# Altium project Combined.PrjPCB
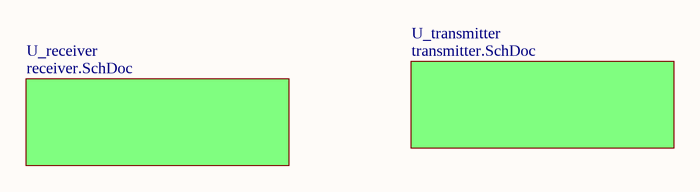
[diagram p0: Combined.SchDoc]
3 sheets, 92 parts. Net scope: global (net labels, ports and power ports of the same name join across sheets).
Board file: Combined.PcbDoc
Sheets:
  Combined.SchDoc
    U_receiver = receiver.SchDoc
    U_transmitter = transmitter.SchDoc

## Sheet Combined.SchDoc
size A

### Sub-sheets
U_receiver = receiver.SchDoc: no entries
U_transmitter = transmitter.SchDoc: no entries

## Sheet receiver.SchDoc: MW Bench - Receiver
size A3; Organization: Altium Limited; Address1: L3, 12a Rodborough Rd; Address2: Frenchs Forest; Address3: NSW; Address4: Australia 2086; SheetNumber: 2; SheetTotal: 2
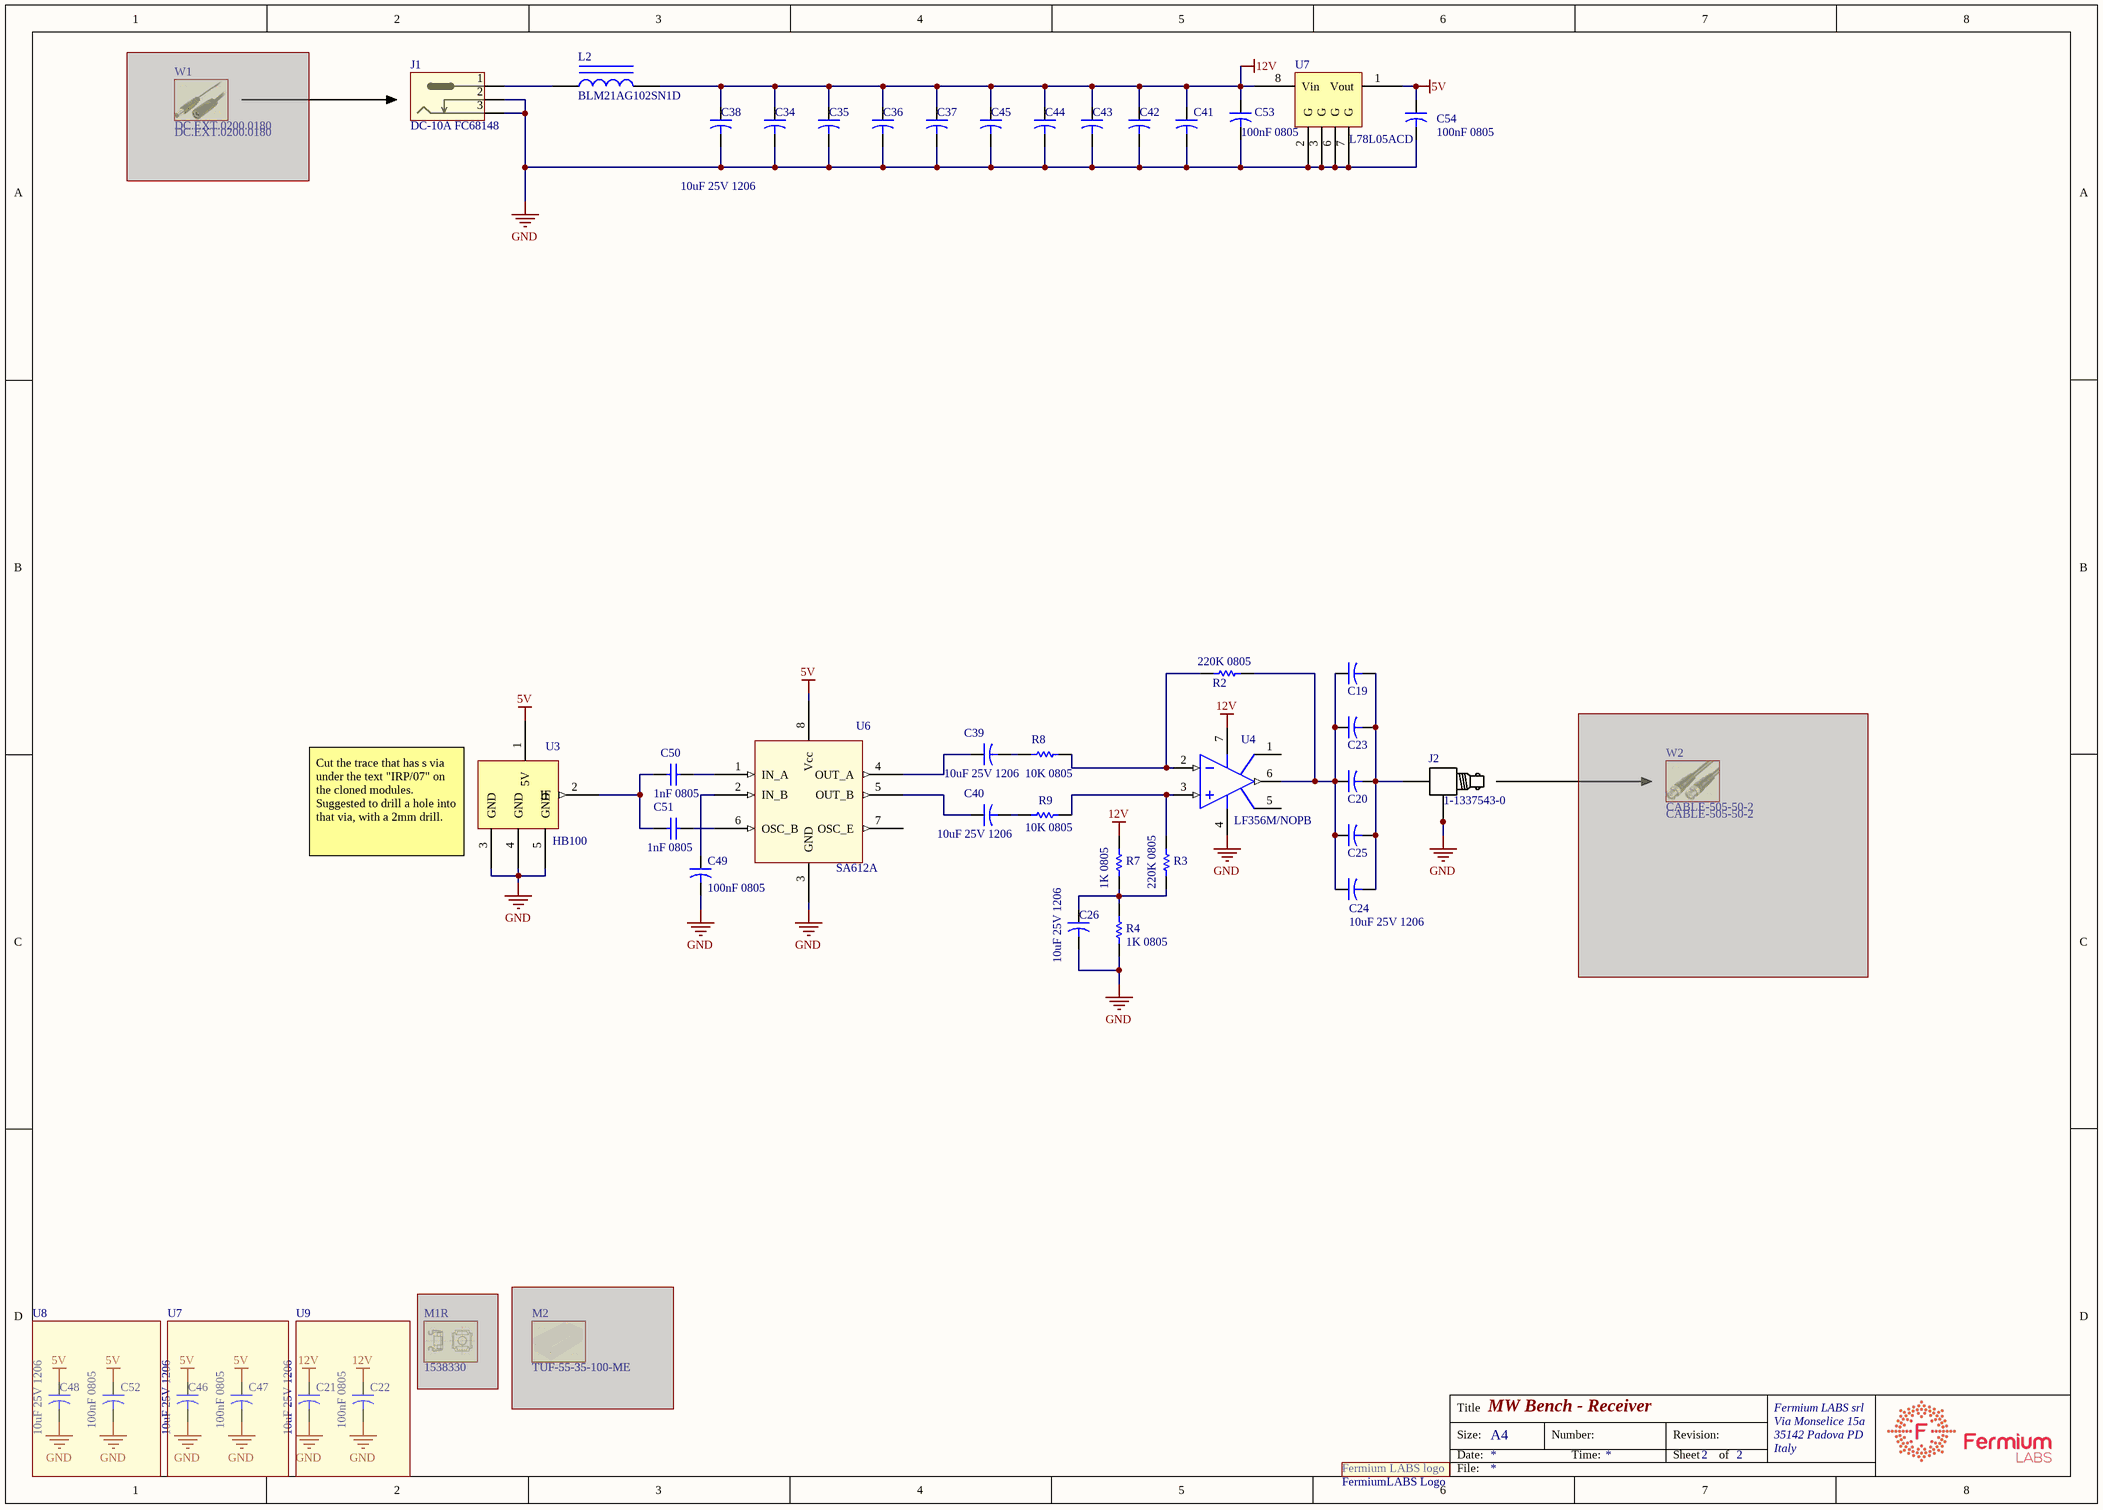
[diagram p1: receiver.SchDoc]

### Parts
(Parts that share a designator on the sheet are numbered #1, #2 ... from top to bottom, then left to right.)
C19  10uF 25V 1206  [CAP 1206_3216]  (value not drawn)
C20  10uF 25V 1206  [CAP 1206_3216]  (value not drawn)
C21  10uF 25V 1206  [CAP 1206_3216]
C22  100nF 0805  [CAP 0805_2012]
C23  10uF 25V 1206  [CAP 1206_3216]  (value not drawn)
C24  10uF 25V 1206  [CAP 1206_3216]
C25  10uF 25V 1206  [CAP 1206_3216]  (value not drawn)
C26  10uF 25V 1206  [CAP 1206_3216]
C34  10uF 25V 1206  [CAP 1206_3216]  (value not drawn)
C35  10uF 25V 1206  [CAP 1206_3216]  (value not drawn)
C36  10uF 25V 1206  [CAP 1206_3216]  (value not drawn)
C37  10uF 25V 1206  [CAP 1206_3216]  (value not drawn)
C38  10uF 25V 1206  [CAP 1206_3216]
C39  10uF 25V 1206  [CAP 1206_3216]
C40  10uF 25V 1206  [CAP 1206_3216]
C41  10uF 25V 1206  [CAP 1206_3216]  (value not drawn)
C42  10uF 25V 1206  [CAP 1206_3216]  (value not drawn)
C43  10uF 25V 1206  [CAP 1206_3216]  (value not drawn)
C44  10uF 25V 1206  [CAP 1206_3216]  (value not drawn)
C45  10uF 25V 1206  [CAP 1206_3216]  (value not drawn)
C46  10uF 25V 1206  [CAP 1206_3216]
C47  100nF 0805  [CAP 0805_2012]
C48  10uF 25V 1206  [CAP 1206_3216]
C49  100nF 0805  [CAP 0805_2012]
C50  1nF 0805  [CAP 0805_2012]
C51  1nF 0805  [CAP 0805_2012]
C52  100nF 0805  [CAP 0805_2012]
C53  100nF 0805  [CAP 0805_2012]
C54  100nF 0805  [CAP 0805_2012]
J1  DC-10A FC68148  [dc-jack]  (no BOM)
J2  1-1337543-0  [BNC-RA]
L2  BLM21AG102SN1D  [FER 0805_2012]
M1R  1538330  (mechanical)  (masked out: inside a compile mask, not in the netlist)
M2#1  TUF-55-35-100-ME  (mechanical)  (masked out: inside a compile mask, not in the netlist)
R2  220K 0805  [RES 0805_2012]
R3  220K 0805  [RES 0805_2012]
R4  1K 0805  [RES 0805_2012]
R7  1K 0805  [RES 0805_2012]
R8  10K 0805  [RES 0805_2012]
R9  10K 0805  [RES 0805_2012]
U3#1  HB100  [HB100-buried]
U4  LF356M/NOPB  [TI SOIC-8 D]
U6  SA612A  [TI SOIC-8 D]
U7  L78L05ACD  [ST SOIC-8N]
W1#1  DC.EXT.0200.0180  (mechanical)  (masked out: inside a compile mask, not in the netlist)
W2#1  CABLE-505-50-2  (mechanical)  (masked out: inside a compile mask, not in the netlist)
XX1  FermiumLABS Logo  [frm-med]  (no BOM)

### Blocks framed on the sheet
U8: C48 C52
U7: C46 C47
U9: C21 C22

### Nets
5V: C46.1 C47.1 C48.1 C52.1 C54.1 U3#1.1(5V) U6.8(Vcc) U7.1(Vout)
12V: C21.1 C22.1 C34.1 C35.1 C36.1 C37.1 C38.1 C41.1 C42.1 C43.1 C44.1 C45.1 C53.1 L2.2 R7.2 U4.7(VDD+) U7.8(Vin)
GND: C21.2 C22.2 C26.2 C34.2 C35.2 C36.2 C37.2 C38.2 C41.2 C42.2 C43.2 C44.2 C45.2 C46.2 C47.2 C48.2 C49.2 C52.2 C53.2 C54.2 J1.2 J1.3 J2.2(gnd) J2.A J2.B R4.1 U3#1.3(GND) U3#1.4(GND) U3#1.5(GND) U4.4(VDD-) U6.3(GND) U7.2(G) U7.3(G) U7.6(G) U7.7(G)
NetC19_1: C19.1 C20.1 C23.1 C24.1 C25.1 R2.2 U4.6(OUT)
NetC19_2: C19.2 C20.2 C23.2 C24.2 C25.2 J2.1
NetC26_1: C26.1 R3.1 R4.2 R7.1
NetC39_1: C39.1 U6.4(OUT_A)
NetC39_2: C39.2 R8.1
NetC40_1: C40.1 U6.5(OUT_B)
NetC40_2: C40.2 R9.1
NetC49_1: C49.1 U6.2(IN_B)
NetC50_1: C50.1 C51.1 U3#1.2(IF)
NetC50_2: C50.2 U6.1(IN_A)
NetC51_2: C51.2 U6.6(OSC_B)
NetJ1_1: J1.1 L2.1
NetR2_1: R2.1 R8.2 U4.2(IN-)
NetR3_2: R3.2 R9.2 U4.3(IN+)

Not connected (* = marked no-connect by the designer): U4 1(CXA) 5; U6 7(OSC_E)

### Notes on the sheet
- (near U3#1) Cut the trace that has s via under the text "IRP/07" on the cloned modules. Suggested to drill a hole into that via, with a 2mm drill.
- Title
- Size:
- Date:
- A4
- Number:
- Time:
- Revision:
- Sheet
- of
- Fermium LABS srl
- Via Monselice 15a
- 35142 Padova PD
- Italy
- File:
- (in symbol fermiumlabs-logo) Fermium LABS logo

### Library data of the parts
C19-C21 C23-C26 C34-C46 C48 = C10uF: Capacitor; Manufacturer: SAMSUNG; Manufacturer Part Number: CL31A106KAHNNNE; Part Number: C10uF
C22 C47 C49 C52-C54 = C100nF: Capacitor; Manufacturer: YAGEO; Manufacturer Part Number: CC0805JRX7R9BB104; Part Number: C100nF
C50 C51 = C1nF: Capacitor; Manufacturer: Samsung; Manufacturer Part Number: CL21B102KCANNNC; Part Number: C1nF
J1 = jackdc: Manufacturer: CLIFF; Manufacturer Part Number: DC-10A FC68148; Part Number: jackdc
J2 = BNC-PCB-RA: connector bnc; Manufacturer: TE CONNECTIVITY; Manufacturer Part Number: 1-1337543-0; Part Number: BNC-PCB-RA
L2 = Inductor Iron: Magnetic-Core Inductor; Manufacturer: Murata; Manufacturer Part Number: BLM21AG102SN1D; Part Number: Inductor Iron
M1R = B6/0.7-1.6/BN3307: Manufacturer: Bossard; Part Number: B6/0.7-1.6/BN3307; Manufacturer Part Number: 1538330
R2 R3 = R220K: Resistor; Manufacturer: Vishay; Manufacturer Part Number: CRCW0805220KFKEA; Part Number: R220K
R4 R7 = R1K: Resistor; Manufacturer: Royal Electronic Factory; Manufacturer Part Number: 0805S8J0102T5E; Part Number: R1K
R8 R9 = R10K: Resistor; Manufacturer: Royal Electronic Factory; Manufacturer Part Number: 0805S8J0103T5E; Part Number: R10K
U3#1 = HB100: Manufacturer: China unspecified; Manufacturer Part Number: HB100; Part Number: HB100
U4 = LF358: Manufacturer: Texas Instruments; Part Number: LF358; Manufacturer Part Number: LF356M/NOPB
U6 = SA612A: Manufacturer: NXP; Manufacturer Part Number: SA612AD; Supplier 1: TME; Supplier 2: Mouser; Supplier Part Number 2: 771-SA612AD01112; Supplier Part Number 1: SA612AD
U7 = L78L05ACD: Manufacturer: ST Microelectronics; Part Number: L78L05ACD; Manufacturer Part Number: L78L05ACD
XX1 = fermiumlabs-logo: Part Number: fermiumlabs-logo
M2#1 = TUF-55-35-100-ME: Supplier 1: TME; Supplier Part Number 1: TUF-55-35-100-ME
W1#1 = DC.EXT.0200.0180: Supplier 1: TME; Supplier Part Number 1: DC.EXT.0200.0180
W2#1 = CABLE-505-50-2: Supplier 1: TME; Supplier Part Number 1: CABLE-505-50-2

## Sheet transmitter.SchDoc: MW Bench - Transmitter
size A3; Organization: Altium Limited; Address1: L3, 12a Rodborough Rd; Address2: Frenchs Forest; Address3: NSW; Address4: Australia 2086; SheetNumber: 1; SheetTotal: 2
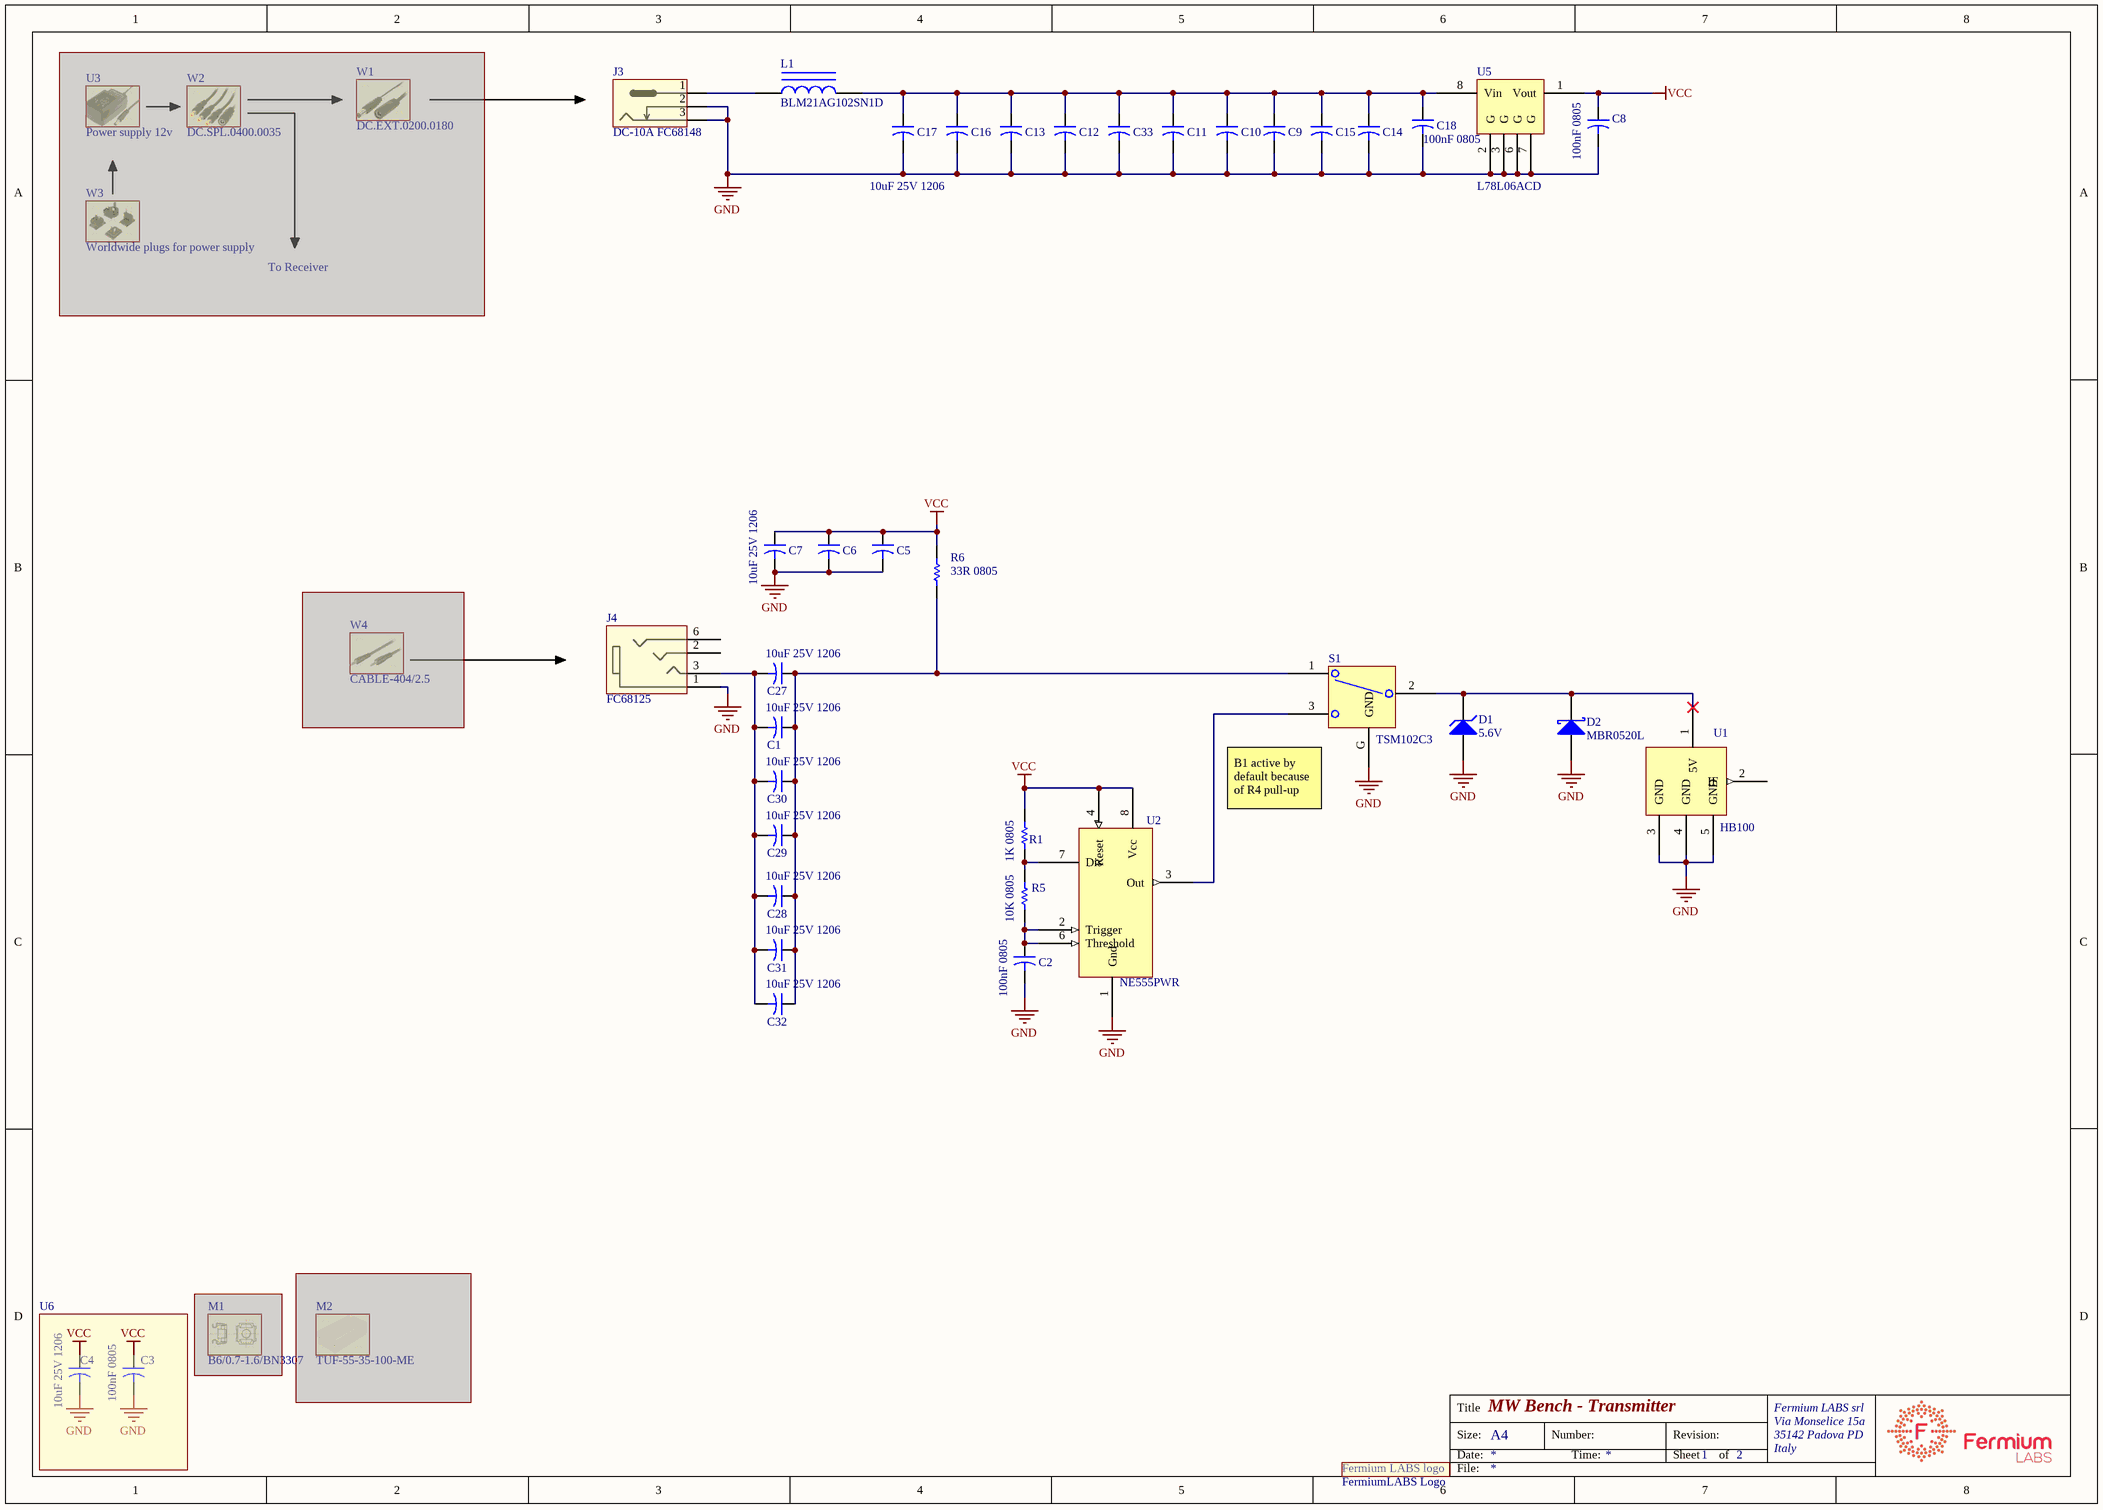
[diagram p2: transmitter.SchDoc]

### Parts
(Parts that share a designator on the sheet are numbered #1, #2 ... from top to bottom, then left to right.)
C1  10uF 25V 1206  [CAP 1206_3216]
C2  100nF 0805  [CAP 0805_2012]
C3  100nF 0805  [CAP 0805_2012]
C4  10uF 25V 1206  [CAP 1206_3216]
C5  10uF 25V 1206  [CAP 1206_3216]  (value not drawn)
C6  10uF 25V 1206  [CAP 1206_3216]  (value not drawn)
C7  10uF 25V 1206  [CAP 1206_3216]
C8  100nF 0805  [CAP 0805_2012]
C9  10uF 25V 1206  [CAP 1206_3216]  (value not drawn)
C10  10uF 25V 1206  [CAP 1206_3216]  (value not drawn)
C11  10uF 25V 1206  [CAP 1206_3216]  (value not drawn)
C12  10uF 25V 1206  [CAP 1206_3216]  (value not drawn)
C13  10uF 25V 1206  [CAP 1206_3216]  (value not drawn)
C14  10uF 25V 1206  [CAP 1206_3216]  (value not drawn)
C15  10uF 25V 1206  [CAP 1206_3216]  (value not drawn)
C16  10uF 25V 1206  [CAP 1206_3216]  (value not drawn)
C17  10uF 25V 1206  [CAP 1206_3216]
C18  100nF 0805  [CAP 0805_2012]
C27  10uF 25V 1206  [CAP 1206_3216]
C28  10uF 25V 1206  [CAP 1206_3216]
C29  10uF 25V 1206  [CAP 1206_3216]
C30  10uF 25V 1206  [CAP 1206_3216]
C31  10uF 25V 1206  [CAP 1206_3216]
C32  10uF 25V 1206  [CAP 1206_3216]
C33  10uF 25V 1206  [CAP 1206_3216]  (value not drawn)
D1  5.6V  [SOD123]
D2  MBR0520L  [SOD123]
J3  DC-10A FC68148  [dc-jack]  (no BOM)
J4  FC68125  [FC68125]
L1  BLM21AG102SN1D  [FER 0805_2012]
M1  B6/0.7-1.6/BN3307  (mechanical)  (masked out: inside a compile mask, not in the netlist)
M2#2  TUF-55-35-100-ME  (mechanical)  (masked out: inside a compile mask, not in the netlist)
R1  1K 0805  [RES 0805_2012]
R5  10K 0805  [RES 0805_2012]
R6  33R 0805  [RES 0805_2012]
S1  TSM102C3  [TSM102C3]
U1  HB100  [HB100-buried]
U2  NE555PWR  [TSSOP8]
U3#2  Power supply 12v  (mechanical)  (masked out: inside a compile mask, not in the netlist)
U5  L78L06ACD  [ST SOIC-8N]
W1#2  DC.EXT.0200.0180  (mechanical)  (masked out: inside a compile mask, not in the netlist)
W2#2  DC.SPL.0400.0035  (mechanical)  (masked out: inside a compile mask, not in the netlist)
W3  Worldwide plugs for power supply  (mechanical)  (masked out: inside a compile mask, not in the netlist)
W4  CABLE-404/2.5  (mechanical)  (masked out: inside a compile mask, not in the netlist)
XX2  FermiumLABS Logo  [frm-med]  (no BOM)

### Blocks framed on the sheet
U6: C3 C4

### Nets
GND: C2.2 C3.2 C4.2 C5.2 C6.2 C7.2 C8.2 C9.2 C10.2 C11.2 C12.2 C13.2 C14.2 C15.2 C16.2 C17.2 C18.2 C33.2 D1.A D2.A J3.2 J3.3 J4.1 S1.G(GND) U1.3(GND) U1.4(GND) U1.5(GND) U2.1(Gnd) U5.2(G) U5.3(G) U5.6(G) U5.7(G)
VCC: C3.1 C4.1 C5.1 C6.1 C7.1 C8.1 R1.2 R6.1 U2.4(Reset) U2.8(Vcc) U5.1(Vout)
NetC1_1: C1.1 C27.1 C28.1 C29.1 C30.1 C31.1 C32.1 R6.2 S1.1
NetC1_2: C1.2 C27.2 C28.2 C29.2 C30.2 C31.2 C32.2 J4.3
NetC2_1: C2.1 R5.1 U2.2(Trigger) U2.6(Threshold)
NetC9_1: C9.1 C10.1 C11.1 C12.1 C13.1 C14.1 C15.1 C16.1 C17.1 C18.1 C33.1 L1.2 U5.8(Vin)
NetD1_K: D1.K D2.K S1.2 U1.1(5V)
NetJ3_1: J3.1 L1.1
NetR1_1: R1.1 R5.2 U2.7(Dis)
NetS1_3: S1.3 U2.3(Out)

Not connected (* = marked no-connect by the designer): J4 2 6; U1 2(IF)

### Notes on the sheet
- To Receiver
- (near S1) B1 active by default because of R4 pull-up
- Title
- Size:
- Date:
- A4
- Number:
- Time:
- Revision:
- Sheet
- of
- Fermium LABS srl
- Via Monselice 15a
- 35142 Padova PD
- Italy
- File:
- (in symbol fermiumlabs-logo) Fermium LABS logo

### Library data of the parts
C1 C4-C7 C9-C17 C27-C33 = C10uF: as C19 on sheet receiver
C2 C3 C8 C18 = C100nF: as C22 on sheet receiver
D1 = D Zener: Zener Diode; Manufacturer: Diodes; Manufacturer Part Number: BZT52C5V6-7-F; Part Number: D Zener
D2 = D Schottky: Schottky Diode; Manufacturer: FAIRCHILD SEMICONDUCTOR; Manufacturer Part Number: MBR0520L; Part Number: D Schottky
J3 = jackdc: Manufacturer: CLIFF; Manufacturer Part Number: DC-10A FC68148; Part Number: jackdc
J4 = FC68125: Manufacturer: CLIFF; Manufacturer Part Number: FC68125; Part Number: FC68125
L1 = Inductor Iron: as L2 on sheet receiver; Manufacturer Part Number: BLM21AG102SN1D; Part Number: Inductor Iron
R1 = R1K: as R4 on sheet receiver
R5 = R10K: as R8 on sheet receiver
R6 = R33: Resistor; Manufacturer: Vishay; Manufacturer Part Number: CRCW080533R0JNTABC; Part Number: R33
S1 = TSM102C3: Manufacturer Part Number: Ninigi; Manufacturer: TSM102C3; Part Number: TSM102C3
U1 = HB100: Manufacturer: China unspecified; Manufacturer Part Number: HB100; Part Number: HB100
U2 = NE555PWR: Manufacturer: Texas Instruments; Manufacturer Part Number: NE555PWR; Part Number: NE555PWR
U3#2 = GE12I12-P1J
U5 = L78L06ACD: Manufacturer: ST Microelectronics; Manufacturer Part Number: L78L06ACD; Part Number: L78L06ACD
W3 = GE-MIX
XX2 = fermiumlabs-logo: Part Number: fermiumlabs-logo

## Nets that join several sheets
GND: receiver (35 pins), transmitter (32 pins)